# EasyEDA schematic KegWasher_1.6_Schematic.json
TITLE: Keg Washer Pi 1.6; REV: 1.6; Date: 2020-08-05; Sheet: 1/1; Drawn By: Kyle Hultman; Company: Kyle Hultman
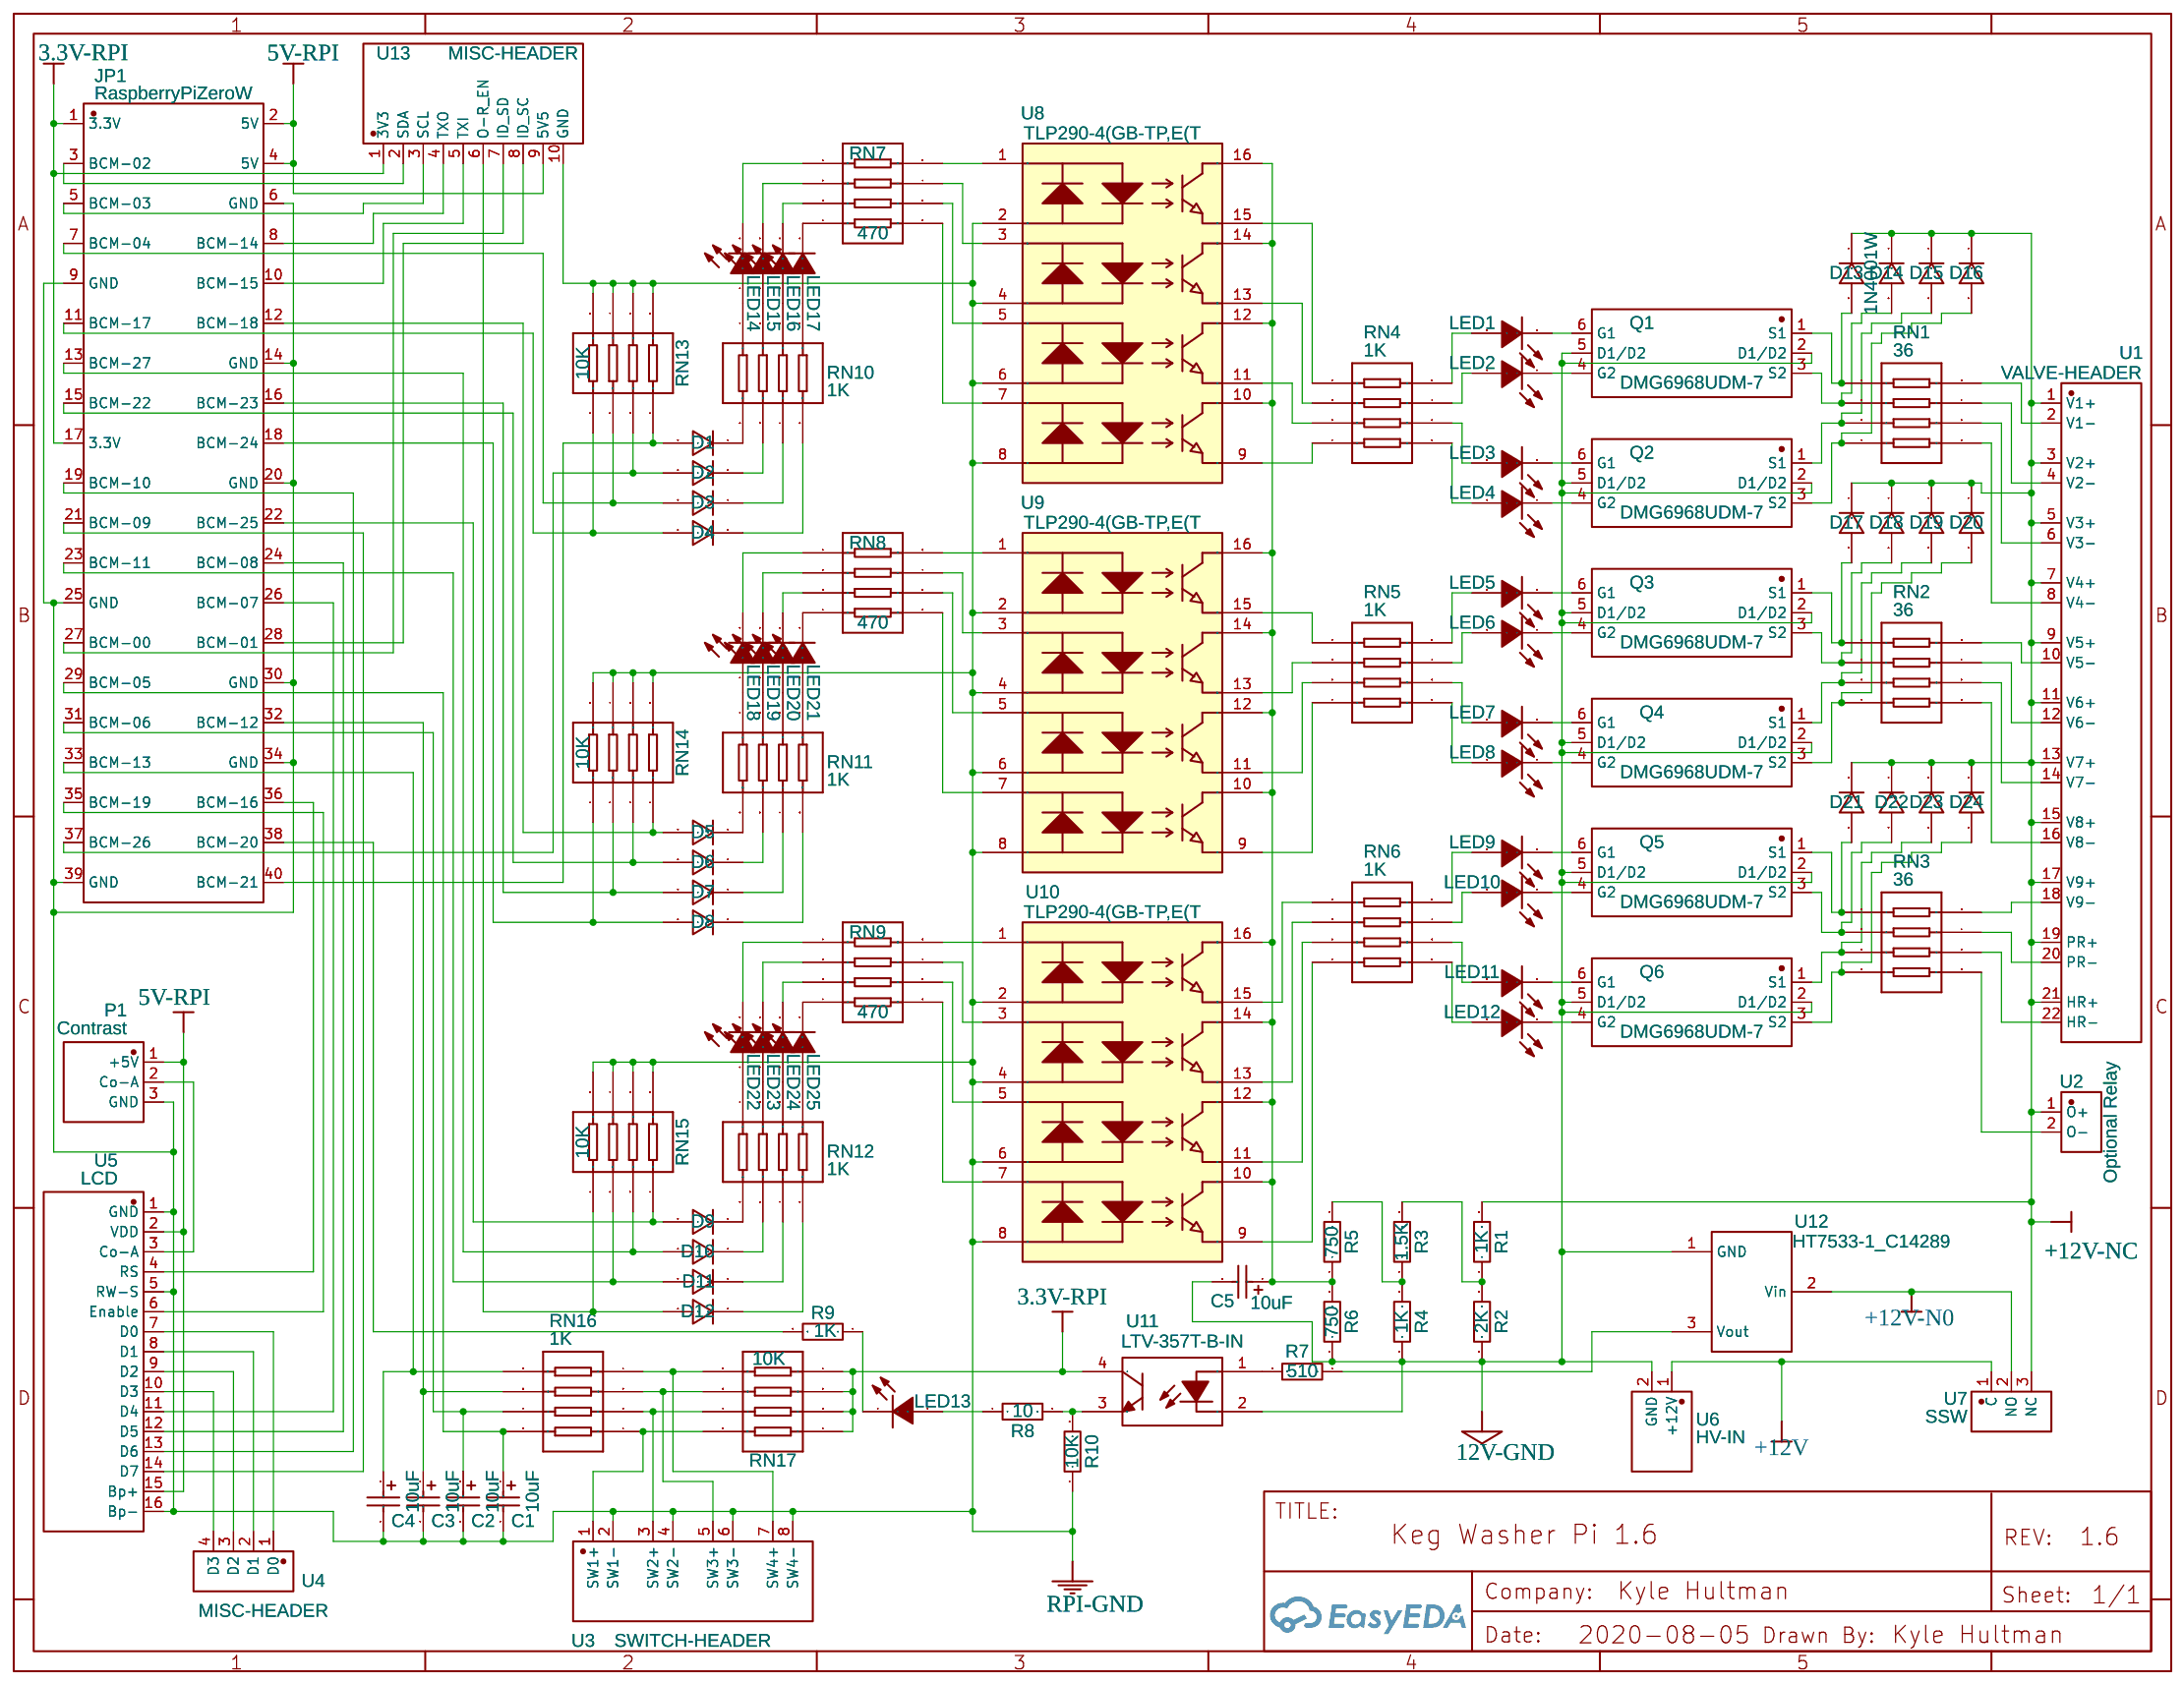
[diagram p0: schematic sheet]

## Parts
C1  10uF  [CAP-SMD_L3.2-W1.6-R-RD]
C2  10uF  [CAP-SMD_L3.2-W1.6-R-RD]
C3  10uF  [CAP-SMD_L3.2-W1.6-R-RD]
C4  10uF  [CAP-SMD_L3.2-W1.6-R-RD]
C5  10uF  [CAP-SMD_L3.2-W1.6-R-RD]
D1  1N4148W_C81598  [SOD-123_L2.8-W1.8-LS3.7-RD]
D2  1N4148W_C81598  [SOD-123_L2.8-W1.8-LS3.7-RD]
D3  1N4148W_C81598  [SOD-123_L2.8-W1.8-LS3.7-RD]
D4  1N4148W_C81598  [SOD-123_L2.8-W1.8-LS3.7-RD]
D5  1N4148W_C81598  [SOD-123_L2.8-W1.8-LS3.7-RD]
D6  1N4148W_C81598  [SOD-123_L2.8-W1.8-LS3.7-RD]
D7  1N4148W_C81598  [SOD-123_L2.8-W1.8-LS3.7-RD]
D8  1N4148W_C81598  [SOD-123_L2.8-W1.8-LS3.7-RD]
D9  1N4148W_C81598  [SOD-123_L2.8-W1.8-LS3.7-RD]
D10  1N4148W_C81598  [SOD-123_L2.8-W1.8-LS3.7-RD]
D11  1N4148W_C81598  [SOD-123_L2.8-W1.8-LS3.7-RD]
D12  1N4148W_C81598  [SOD-123_L2.8-W1.8-LS3.7-RD]
D13  1N4001W  [SOD-123F_L2.8-W1.8-LS3.7-RD]
D14  1N4001W  [SOD-123F_L2.8-W1.8-LS3.7-RD]
D15  1N4001W  [SOD-123F_L2.8-W1.8-LS3.7-RD]
D16  1N4001W  [SOD-123F_L2.8-W1.8-LS3.7-RD]
D17  1N4001W  [SOD-123F_L2.8-W1.8-LS3.7-RD]
D18  1N4001W  [SOD-123F_L2.8-W1.8-LS3.7-RD]
D19  1N4001W  [SOD-123F_L2.8-W1.8-LS3.7-RD]
D20  1N4001W  [SOD-123F_L2.8-W1.8-LS3.7-RD]
D21  1N4001W  [SOD-123F_L2.8-W1.8-LS3.7-RD]
D22  1N4001W  [SOD-123F_L2.8-W1.8-LS3.7-RD]
D23  1N4001W  [SOD-123F_L2.8-W1.8-LS3.7-RD]
D24  1N4001W  [SOD-123F_L2.8-W1.8-LS3.7-RD]
JP1  RaspberryPiZeroW  [2X20-SHROUDED]
LED1  17-21SUYC/TR8  [LED0805-RD]
LED2  17-21SUYC/TR8  [LED0805-RD]
LED3  17-21SUYC/TR8  [LED0805-RD]
LED4  17-21SUYC/TR8  [LED0805-RD]
LED5  17-21SUYC/TR8  [LED0805-RD]
LED6  17-21SUYC/TR8  [LED0805-RD]
LED7  17-21SUYC/TR8  [LED0805-RD]
LED8  17-21SUYC/TR8  [LED0805-RD]
LED9  17-21SUYC/TR8  [LED0805-RD]
LED10  17-21SUYC/TR8  [LED0805-RD]
LED11  17-21SUYC/TR8  [LED0805-RD]
LED12  17-21SUYC/TR8  [LED0805-RD]
LED13  17-21SUYC/TR8  [LED0805-RD]
LED14  19-217/R6C-AL1M2VY/3T  [LED0603-R-RD]
LED15  19-217/R6C-AL1M2VY/3T  [LED0603-R-RD]
LED16  19-217/R6C-AL1M2VY/3T  [LED0603-R-RD]
LED17  19-217/R6C-AL1M2VY/3T  [LED0603-R-RD]
LED18  19-217/R6C-AL1M2VY/3T  [LED0603-R-RD]
LED19  19-217/R6C-AL1M2VY/3T  [LED0603-R-RD]
LED20  19-217/R6C-AL1M2VY/3T  [LED0603-R-RD]
LED21  19-217/R6C-AL1M2VY/3T  [LED0603-R-RD]
LED22  19-217/R6C-AL1M2VY/3T  [LED0603-R-RD]
LED23  19-217/R6C-AL1M2VY/3T  [LED0603-R-RD]
LED24  19-217/R6C-AL1M2VY/3T  [LED0603-R-RD]
LED25  19-217/R6C-AL1M2VY/3T  [LED0603-R-RD]
P1  Contrast  [3P]
Q1  DMG6968UDM-7  [SOT-23-6_L2.9-W1.6-P0.95-LS2.8-BR]
Q2  DMG6968UDM-7  [SOT-23-6_L2.9-W1.6-P0.95-LS2.8-BR]
Q3  DMG6968UDM-7  [SOT-23-6_L2.9-W1.6-P0.95-LS2.8-BR]
Q4  DMG6968UDM-7  [SOT-23-6_L2.9-W1.6-P0.95-LS2.8-BR]
Q5  DMG6968UDM-7  [SOT-23-6_L2.9-W1.6-P0.95-LS2.8-BR]
Q6  DMG6968UDM-7  [SOT-23-6_L2.9-W1.6-P0.95-LS2.8-BR]
R1  1K  [R0805]
R2  2K  [R0805]
R3  1.5K  [R0805]
R4  1K  [R0805]
R5  750  [R0603]
R6  750  [R0603]
R7  510  [R0603]
R8  10  [R0603]
R9  1K  [R0805]
R10  10K  [R1206]
RN1  36  [RES-ARRAY-SMD_0402-8P-L2.0-W1.0-BL]
RN2  36  [RES-ARRAY-SMD_0402-8P-L2.0-W1.0-BL]
RN3  36  [RES-ARRAY-SMD_0402-8P-L2.0-W1.0-BL]
RN4  1K  [RES-ARRAY-SMD_0402-8P-L2.0-W1.0-BL]
RN5  1K  [RES-ARRAY-SMD_0402-8P-L2.0-W1.0-BL]
RN6  1K  [RES-ARRAY-SMD_0402-8P-L2.0-W1.0-BL]
RN7  470  [RES-ARRAY-SMD_0603-8P-L3.2-W1.6-BL]
RN8  470  [RES-ARRAY-SMD_0603-8P-L3.2-W1.6-BL]
RN9  470  [RES-ARRAY-SMD_0603-8P-L3.2-W1.6-BL]
RN10  1K  [RES-ARRAY-SMD_0402-8P-L2.0-W1.0-BL]
RN11  1K  [RES-ARRAY-SMD_0402-8P-L2.0-W1.0-BL]
RN12  1K  [RES-ARRAY-SMD_0402-8P-L2.0-W1.0-BL]
RN13  10K  [RES-ARRAY-SMD_0402-8P-L2.0-W1.0-BL]
RN14  10K  [RES-ARRAY-SMD_0402-8P-L2.0-W1.0-BL]
RN15  10K  [RES-ARRAY-SMD_0402-8P-L2.0-W1.0-BL]
RN16  1K  [RES-ARRAY-SMD_0402-8P-L2.0-W1.0-BL]
RN17  10K  [RES-ARRAY-SMD_0402-8P-L2.0-W1.0-BL]
U1  VALVE-HEADER  [PIN_HEADER_STRAIGHT_1X22_PITCH2.54MM]
U2  Optional Relay  [2P]
U3  SWITCH-HEADER  [HDR-M-2.54_1X8]
U4  MISC-HEADER  [HDR-M-2.54_1X4]
U5  LCD  [HDR-M-2.54_1X16]
U6  HV-IN  [2P]
U7  SSW  [3P]
U8  TLP290-4(GB-TP,E(T  [SOIC-16_L9.9-W3.9-P1.27-LS6.0-BL]
U9  TLP290-4(GB-TP,E(T  [SOIC-16_L9.9-W3.9-P1.27-LS6.0-BL]
U10  TLP290-4(GB-TP,E(T  [SOIC-16_L9.9-W3.9-P1.27-LS6.0-BL]
U11  LTV-357T-B-IN  [SOP-4_L3.9-W4.4-P2.54-LS7.0-TL]
U12  HT7533-1_C14289  [SOT-89-3_L4.5-W2.5-P1.50-LS4.2-BR]
U13  MISC-HEADER  [RESSIP-10]

## Library data of the parts
C1-C5 = TAJA106K016RNJ: Supplier: LCSC; Manufacturer: AVX; LCSC Assembly: Yes; Supplier Part: C7171; SMT Type: Basic
D1-D12 = 1N4148W_C81598: Supplier: LCSC; Manufacturer: SEMTECH; Manufacturer Part: 1N4148W; image: //image.lceda.cn/szlcsc/C81598.jpg; Supplier Part: C81598; LCSC Assembly: Yes; SMT Type: Basic
D13-D24 = 1N4001W: Supplier Part: C162732; Supplier: LCSC; Manufacturer: Jingdao; Contributor: LCSC; LCSC Assembly: Yes; SMT Type: Extend
JP1 = RaspberryPiZeroW
LED1-LED13 = 17-21SUYC/TR8: Supplier: LCSC; Manufacturer: KENTO; LCSC Assembly: Yes; image: //image.lceda.cn/szlcsc/C2296.jpg; Supplier Part: C2296; SMT Type: Basic
LED14-LED25 = 19-217/R6C-AL1M2VY/3T: Supplier: LCSC; Manufacturer: EVERLIGHT; image: //image.lceda.cn/szlcsc/C72044.jpg; Supplier Part: C72044; LCSC Assembly: Yes; SMT Type: Extend
P1 = Contrast
Q1-Q6 = DMG6968UDM-7: Supplier: LCSC; Manufacturer: DIODES; Contributor: LCSC; Supplier Part: C151635; LCSC Assembly: Yes; SMT Type: Extend
R1 R4 R9 = 0805W8F1001T5E: Supplier: LCSC; Manufacturer: UniOhm; LCSC Assembly: Yes; Supplier Part: C17513; SMT Type: Basic
R2 = 0805W8F2001T5E: Supplier: LCSC; Manufacturer: UniOhm; LCSC Assembly: Yes; Supplier Part: C17604; SMT Type: Basic
R3 = 0805W8F1501T5E: Supplier: LCSC; Manufacturer: UniOhm; LCSC Assembly: Yes; Supplier Part: C4310; SMT Type: Basic
R5 R6 = 0603WAF7500T5E: Supplier: LCSC; Manufacturer: UniOhm; LCSC Assembly: Yes; Supplier Part: C23241; SMT Type: Basic
R7 = 0603WAF5100T5E: Supplier: LCSC; Manufacturer: UniOhm; LCSC Assembly: Yes; Supplier Part: C23193; SMT Type: Basic
R8 = 0603WAF100JT5E: Supplier: LCSC; Manufacturer: UniOhm; LCSC Assembly: Yes; Supplier Part: C22859; SMT Type: Basic
R10 = 1206W4F1002T5E: Supplier: LCSC; Manufacturer: UniOhm; LCSC Assembly: Yes; Supplier Part: C17902; SMT Type: Basic
RN1-RN3 = 4D02WGJ0360TCE: Supplier: LCSC; Manufacturer: UniOhm; Supplier Part: C25502; LCSC Assembly: Yes; SMT Type: Extend
RN4-RN6 RN10-RN12 RN16 = 4D02WGJ0102TCE: Supplier: LCSC; Manufacturer: UniOhm; LCSC Assembly: Yes; Supplier Part: C25726; SMT Type: Basic
RN7-RN9 = 4D03WGJ0471T5E: Supplier: LCSC; Manufacturer: UniOhm; LCSC Assembly: Yes; Supplier Part: C25510; SMT Type: Basic
RN13-RN15 RN17 = 4D02WGJ0103TCE: Supplier: LCSC; Manufacturer: UniOhm; LCSC Assembly: Yes; Supplier Part: C25725; SMT Type: Basic
U1 = VALVE-HEADER
U2 = Optional Relay
U3 = SWITCH-HEADER
U4 U13 = MISC-HEADER
U5 = LCD
U6 = HV-IN
U7 = SSW
U8-U10 = TLP290-4(GB-TP,E(T: Supplier: LCSC; Manufacturer: TOSHIBA; image: //image.lceda.cn/szlcsc/C39031.jpg; Supplier Part: C39031; LCSC Assembly: Yes; SMT Type: Extend
U11 = LTV-357T-B-IN: Supplier: LCSC; Supplier Part: C406713; Manufacturer: Lite-On; Contributor: LCSC; LCSC Assembly: Yes; SMT Type: Extend
U12 = HT7533-1_C14289: Supplier: LCSC; Manufacturer: HOLTEK; Manufacturer Part: HT7533-1; LCSC Assembly: Yes; image: //image.lceda.cn/szlcsc/C14289.jpg; Supplier Part: C14289; SMT Type: Basic

## Nets
3.3V-RPI: JP1.1(3.3V) JP1.17(3.3V) RN17.1 RN17.2 RN17.3 RN17.4 U11.4 U13.1(3V3)
5V-RPI: JP1.2(5V) JP1.4(5V) P1.1(+5V) U5.2(VDD) U5.15(Bp+) U13.9(5V5)
12V-GND: C5.2 Q1.2(D1/D2) Q1.5(D1/D2) Q2.2(D1/D2) Q2.5(D1/D2) Q3.2(D1/D2) Q3.5(D1/D2) Q4.2(D1/D2) Q4.5(D1/D2) Q5.2(D1/D2) Q5.5(D1/D2) Q6.2(D1/D2) Q6.5(D1/D2) R2.1 R4.1 R6.1 U6.2(GND) U11.2 U12.1(GND)
+12V: U6.1(+12V) U7.1(C)
+12V-N0: U7.2(NO) U12.2(Vin)
+12V-NC: D13.1(C) D14.1(C) D15.1(C) D16.1(C) D17.1(C) D18.1(C) D19.1(C) D20.1(C) D21.1(C) D22.1(C) D23.1(C) D24.1(C) R1.2 U1.1(V1+) U1.3(V2+) U1.5(V3+) U1.7(V4+) U1.9(V5+) U1.11(V6+) U1.13(V7+) U1.15(V8+) U1.17(V9+) U1.19(PR+) U1.21(HR+) U2.1(O+) U7.3(NC)
RPI-GND: C1.2 C2.2 C3.2 C4.2 JP1.6(GND) JP1.9(GND) JP1.14(GND) JP1.20(GND) JP1.25(GND) JP1.30(GND) JP1.34(GND) JP1.39(GND) P1.3(GND) R10.1 RN13.5 RN13.6 RN13.7 RN13.8 RN14.5 RN14.6 RN14.7 RN14.8 RN15.5 RN15.6 RN15.7 RN15.8 U3.2(SW1-) U3.4(SW2-) U3.6(SW3-) U3.8(SW4-) U5.1(GND) U5.5(RW-S) U5.16(Bp-) U8.2 U8.4 U8.6 U8.8 U9.2 U9.4 U9.6 U9.8 U10.2 U10.4 U10.6 U10.8 U13.10(GND)
Net-(C1-1): C1.1 JP1.29(BCM-05) RN16.8
Net-(C2-1): C2.1 JP1.31(BCM-06) RN16.7
Net-(C3-1): C3.1 JP1.32(BCM-12) RN16.6
Net-(C4-1): C4.1 JP1.33(BCM-13) RN16.5
Net-(C5-1): C5.1 R5.1 R6.2 U8.10 U8.12 U8.14 U8.16 U9.10 U9.12 U9.14 U9.16 U10.10 U10.12 U10.14 U10.16
Net-(D1-1): D1.1(K) RN10.5
Net-(D1-2): D1.2(A) JP1.40(BCM-21) RN13.4
Net-(D2-1): D2.1(K) RN10.6
Net-(D2-2): D2.2(A) JP1.37(BCM-26) RN13.3
Net-(D3-1): D3.1(K) RN10.7
Net-(D3-2): D3.2(A) JP1.7(BCM-04) RN13.2
Net-(D4-1): D4.1(K) RN10.8
Net-(D4-2): D4.2(A) JP1.11(BCM-17) RN13.1
Net-(D5-1): D5.1(K) RN11.5
Net-(D5-2): D5.2(A) JP1.12(BCM-18) RN14.4
Net-(D6-1): D6.1(K) RN11.6
Net-(D6-2): D6.2(A) JP1.15(BCM-22) RN14.3
Net-(D7-1): D7.1(K) RN11.7
Net-(D7-2): D7.2(A) JP1.16(BCM-23) RN14.2
Net-(D8-1): D8.1(K) RN11.8
Net-(D8-2): D8.2(A) JP1.18(BCM-24) RN14.1
Net-(D9-1): D9.1(K) RN12.5
Net-(D9-2): D9.2(A) JP1.22(BCM-25) RN15.4
Net-(D10-1): D10.1(K) RN12.6
Net-(D10-2): D10.2(A) JP1.13(BCM-27) RN15.3
Net-(D11-1): D11.1(K) RN12.7
Net-(D11-2): D11.2(A) JP1.23(BCM-11) RN15.2
Net-(D12-1): D12.1(K) RN12.8
Net-(D12-2): D12.2(A) RN15.1 U13.6(O-R_EN)
Net-(D13-2): D13.2(A) Q1.1(S1) RN1.1
Net-(D14-2): D14.2(A) Q1.3(S2) RN1.2
Net-(D15-2): D15.2(A) Q2.1(S1) RN1.3
Net-(D16-2): D16.2(A) Q2.3(S2) RN1.4
Net-(D17-2): D17.2(A) Q3.1(S1) RN2.1
Net-(D18-2): D18.2(A) Q3.3(S2) RN2.2
Net-(D19-2): D19.2(A) Q4.1(S1) RN2.3
Net-(D20-2): D20.2(A) Q4.3(S2) RN2.4
Net-(D21-2): D21.2(A) Q5.1(S1) RN3.1
Net-(D22-2): D22.2(A) Q5.3(S2) RN3.2
Net-(D23-2): D23.2(A) Q6.1(S1) RN3.3
Net-(D24-2): D24.2(A) Q6.3(S2) RN3.4
Net-(JP1-3): JP1.3(BCM-02) U13.2(SDA)
Net-(JP1-5): JP1.5(BCM-03) U13.3(SCL)
Net-(JP1-8): JP1.8(BCM-14) U13.4(TXO)
Net-(JP1-10): JP1.10(BCM-15) U13.5(TXI)
Net-(JP1-19): JP1.19(BCM-10) U5.13(D6)
Net-(JP1-21): JP1.21(BCM-09) U5.14(D7)
Net-(JP1-24): JP1.24(BCM-08) U5.12(D5)
Net-(JP1-26): JP1.26(BCM-07) U5.11(D4)
Net-(JP1-27): JP1.27(BCM-00) U13.7(ID_SD)
Net-(JP1-28): JP1.28(BCM-01) U13.8(ID_SC)
Net-(JP1-35): JP1.35(BCM-19) U5.6(Enable)
Net-(JP1-36): JP1.36(BCM-16) U5.4(RS)
Net-(JP1-38): JP1.38(BCM-20) R9.2
Net-(LED1-1): LED1.1(-) Q1.6(G1)
Net-(LED1-2): LED1.2(+) RN4.8
Net-(LED2-1): LED2.1(-) Q1.4(G2)
Net-(LED2-2): LED2.2(+) RN4.7
Net-(LED3-1): LED3.1(-) Q2.6(G1)
Net-(LED3-2): LED3.2(+) RN4.6
Net-(LED4-1): LED4.1(-) Q2.4(G2)
Net-(LED4-2): LED4.2(+) RN4.5
Net-(LED5-1): LED5.1(-) Q3.6(G1)
Net-(LED5-2): LED5.2(+) RN5.8
Net-(LED6-1): LED6.1(-) Q3.4(G2)
Net-(LED6-2): LED6.2(+) RN5.7
Net-(LED7-1): LED7.1(-) Q4.6(G1)
Net-(LED7-2): LED7.2(+) RN5.6
Net-(LED8-1): LED8.1(-) Q4.4(G2)
Net-(LED8-2): LED8.2(+) RN5.5
Net-(LED9-1): LED9.1(-) Q5.6(G1)
Net-(LED9-2): LED9.2(+) RN6.8
Net-(LED10-1): LED10.1(-) Q5.4(G2)
Net-(LED10-2): LED10.2(+) RN6.7
Net-(LED11-1): LED11.1(-) Q6.6(G1)
Net-(LED11-2): LED11.2(+) RN6.6
Net-(LED12-1): LED12.1(-) Q6.4(G2)
Net-(LED12-2): LED12.2(+) RN6.5
Net-(LED13-1): LED13.1(-) R9.1
Net-(LED13-2): LED13.2(+) R8.1
Net-(LED14-1): LED14.1(A) RN10.4
Net-(LED14-2): LED14.2(C) RN7.1
Net-(LED15-1): LED15.1(A) RN10.3
Net-(LED15-2): LED15.2(C) RN7.2
Net-(LED16-1): LED16.1(A) RN10.2
Net-(LED16-2): LED16.2(C) RN7.3
Net-(LED17-1): LED17.1(A) RN10.1
Net-(LED17-2): LED17.2(C) RN7.4
Net-(LED18-1): LED18.1(A) RN11.4
Net-(LED18-2): LED18.2(C) RN8.1
Net-(LED19-1): LED19.1(A) RN11.3
Net-(LED19-2): LED19.2(C) RN8.2
Net-(LED20-1): LED20.1(A) RN11.2
Net-(LED20-2): LED20.2(C) RN8.3
Net-(LED21-1): LED21.1(A) RN11.1
Net-(LED21-2): LED21.2(C) RN8.4
Net-(LED22-1): LED22.1(A) RN12.4
Net-(LED22-2): LED22.2(C) RN9.1
Net-(LED23-1): LED23.1(A) RN12.3
Net-(LED23-2): LED23.2(C) RN9.2
Net-(LED24-1): LED24.1(A) RN12.2
Net-(LED24-2): LED24.2(C) RN9.3
Net-(LED25-1): LED25.1(A) RN12.1
Net-(LED25-2): LED25.2(C) RN9.4
Net-(P1-2): P1.2(Co-A) U5.3(Co-A)
Net-(R1-1): R1.1 R2.2 R3.2
Net-(R3-1): R3.1 R4.2 R5.2
Net-(R7-1): R7.1 U12.3(Vout)
Net-(R7-2): R7.2 U11.1
Net-(R8-2): R8.2 R10.2 U11.3
Net-(RN1-5): RN1.5 U1.8(V4-)
Net-(RN1-6): RN1.6 U1.6(V3-)
Net-(RN1-7): RN1.7 U1.4(V2-)
Net-(RN1-8): RN1.8 U1.2(V1-)
Net-(RN2-5): RN2.5 U1.16(V8-)
Net-(RN2-6): RN2.6 U1.14(V7-)
Net-(RN2-7): RN2.7 U1.12(V6-)
Net-(RN2-8): RN2.8 U1.10(V5-)
Net-(RN3-5): RN3.5 U2.2(O-)
Net-(RN3-6): RN3.6 U1.22(HR-)
Net-(RN3-7): RN3.7 U1.20(PR-)
Net-(RN3-8): RN3.8 U1.18(V9-)
Net-(RN4-1): RN4.1 U8.15
Net-(RN4-2): RN4.2 U8.13
Net-(RN4-3): RN4.3 U8.11
Net-(RN4-4): RN4.4 U8.9
Net-(RN5-1): RN5.1 U9.15
Net-(RN5-2): RN5.2 U9.13
Net-(RN5-3): RN5.3 U9.11
Net-(RN5-4): RN5.4 U9.9
Net-(RN6-1): RN6.1 U10.15
Net-(RN6-2): RN6.2 U10.13
Net-(RN6-3): RN6.3 U10.11
Net-(RN6-4): RN6.4 U10.9
Net-(RN7-5): RN7.5 U8.7
Net-(RN7-6): RN7.6 U8.5
Net-(RN7-7): RN7.7 U8.3
Net-(RN7-8): RN7.8 U8.1
Net-(RN8-5): RN8.5 U9.7
Net-(RN8-6): RN8.6 U9.5
Net-(RN8-7): RN8.7 U9.3
Net-(RN8-8): RN8.8 U9.1
Net-(RN9-5): RN9.5 U10.7
Net-(RN9-6): RN9.6 U10.5
Net-(RN9-7): RN9.7 U10.3
Net-(RN9-8): RN9.8 U10.1
Net-(RN16-1): RN16.1 RN17.8 U3.1(SW1+)
Net-(RN16-2): RN16.2 RN17.7 U3.3(SW2+)
Net-(RN16-3): RN16.3 RN17.6 U3.5(SW3+)
Net-(RN16-4): RN16.4 RN17.5 U3.7(SW4+)
Net-(U4-1): U4.1(D0) U5.7(D0)
Net-(U4-2): U4.2(D1) U5.8(D1)
Net-(U4-3): U4.3(D2) U5.9(D2)
Net-(U4-4): U4.4(D3) U5.10(D3)
